# EAGLE design ArduinoNano LearningBot 4-16-18 (EAGLE 8.4.1)
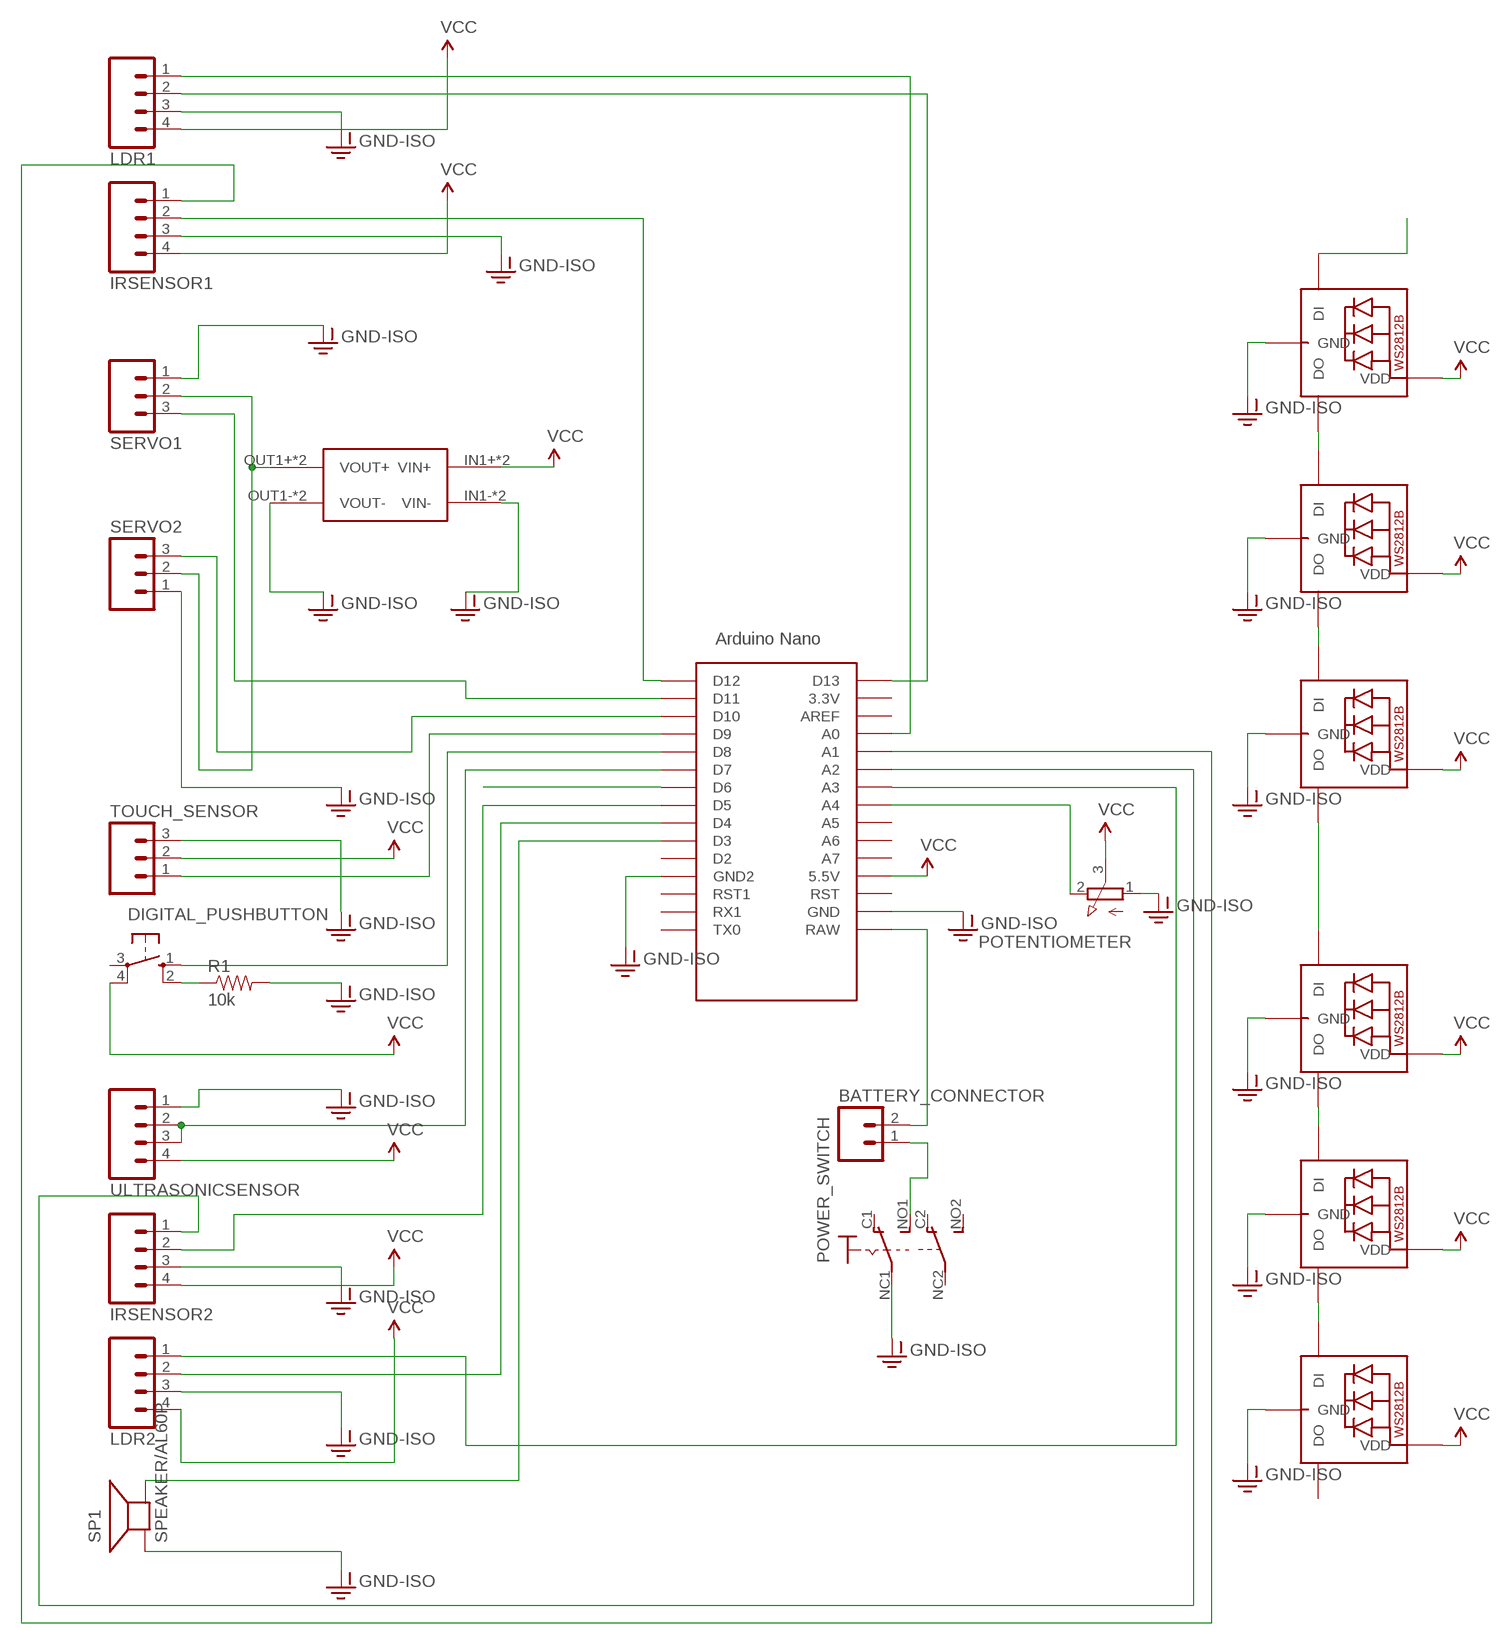
[diagram p0: schematic, sheet 1]

## Parts
BATTERY_CONNECTOR  M02-JST-2-PTH-NO_SILK  [JST-2-PTH-NS]
DIGITAL_PUSHBUTTON  10-XX  [B3F-10XX]
IRSENSOR1  M04LOCK  [1X04_LOCK]
IRSENSOR2  M04LOCK  [1X04_LOCK]
LDR1  M04LOCK  [1X04_LOCK]
LDR2  M04LOCK  [1X04_LOCK]
LED-1  WS2812B5050  [WS2812B]
LED-2  WS2812B5050  [WS2812B]
LED-3  WS2812B5050  [WS2812B]
LED-4  WS2812B5050  [WS2812B]
LED-5  WS2812B5050  [WS2812B]
LED-6  WS2812B5050  [WS2812B]
POTENTIOMETER  3RP/1610N-VERTICAL  [3RP/1610N-VERTICAL]
POWER_SWITCH  SWITCH_320-938  [PS22F03]
R1  10k  RESISTORPTH-1/4W  [AXIAL-0.4]
SERVO1  M03LOCK  [1X03_LOCK]
SERVO2  M03LOCK  [1X03_LOCK]
SP1  SPEAKER/AL60P  [AL60P]
TOUCH_SENSOR  M03LOCK  [1X03_LOCK]
U$1  ARDUINO-CLONE_NANO  [ARDUINO-CLONE_NANO]
U$3  MP1584  [DC-BRICK]
ULTRASONICSENSOR  M04LOCK  [1X04_LOCK]

## Nets
BUTTON: DIGITAL_PUSHBUTTON.1(S) U$1.D8
GND: IRSENSOR1.3 IRSENSOR2.3 LDR1.3 LDR2.3 LED-1.3-GND(GND) LED-2.3-GND(GND) LED-3.3-GND(GND) LED-4.3-GND(GND) LED-5.3-GND(GND) LED-6.3-GND(GND) POTENTIOMETER.1(A) POWER_SWITCH.NC1(1:P) R1.P$2 SERVO1.1 SP1.1(+) TOUCH_SENSOR.3 U$1.GND U$1.GND1(GND2) ULTRASONICSENSOR.1 ; supply symbol labelled GND-ISO
GND-ISO: U$3.IN1-(VIN-) U$3.IN2-(VIN-) U$3.OUT1-(VOUT-) U$3.OUT2-(VOUT-)
IR_SENSOR1_AO: IRSENSOR1.1 U$1.A1
IR_SENSOR1_DO: IRSENSOR1.2 U$1.D12
IR_SENSOR2_AO: IRSENSOR2.1 U$1.A2
IR_SENSOR2_DO: IRSENSOR2.2 U$1.D5
LDR1_AO: LDR1.1 U$1.A0
LDR1_DO: LDR1.2 U$1.D13
LDR2_AO: LDR2.1 U$1.A3
LDR2_DO: LDR2.2 U$1.D4
LED-1: LED-2.4-DIN(DI) U$1.D6
N$1: LED-1.4-DIN(DI) LED-3.2-DOUT(DO)
N$2: LED-4.2-DOUT(DO) LED-5.4-DIN(DI)
N$3: DIGITAL_PUSHBUTTON.2(S1) R1.P$1
N$4: LED-5.2-DOUT(DO) LED-6.4-DIN(DI)
N$5: LED-2.2-DOUT(DO) LED-3.4-DIN(DI)
N$6: LED-1.2-DOUT(DO) LED-4.4-DIN(DI)
N$9: BATTERY_CONNECTOR.1 POWER_SWITCH.NO1(1:S)
POTPIN: POTENTIOMETER.2(E) U$1.A4
RAWIN: BATTERY_CONNECTOR.2 U$1.RAW
SERVO1_PIN: SERVO1.3 U$1.D11
SERVO2_PIN: SERVO2.3 U$1.D10
SERVOGND: SERVO2.1 ; supply symbol labelled GND-ISO
SERVOVCC: SERVO1.2 SERVO2.2 U$3.OUT1+(VOUT+) U$3.OUT2+(VOUT+)
SPEAKERPIN: SP1.2(-) U$1.D3
TOUCH_SENSOR: TOUCH_SENSOR.1 U$1.D9
ULTRASONICSENSOR_PIN: U$1.D7 ULTRASONICSENSOR.2 ULTRASONICSENSOR.3
VCC: DIGITAL_PUSHBUTTON.4(P1) IRSENSOR1.4 IRSENSOR2.4 LDR1.4 LDR2.4 LED-1.1-VDD(VDD) LED-2.1-VDD(VDD) LED-3.1-VDD(VDD) LED-4.1-VDD(VDD) LED-5.1-VDD(VDD) LED-6.1-VDD(VDD) POTENTIOMETER.3(S) TOUCH_SENSOR.2 U$1.5V(5.5V) U$3.IN1+(VIN+) U$3.IN2+(VIN+) ULTRASONICSENSOR.4
Unconnected: DIGITAL_PUSHBUTTON.3(P) LED-6.2-DOUT(DO) POWER_SWITCH.C1(1:O) POWER_SWITCH.C2(B:O) POWER_SWITCH.NC2(B:P) POWER_SWITCH.NO2(B:S) U$1.3.3V U$1.A5 U$1.A6 U$1.A7 U$1.AREF U$1.D2 U$1.RST U$1.RST1 U$1.RX1 U$1.TX0

## Library data of the parts
BATTERY_CONNECTOR = SparkFun-Connectors:M02: Standard 2-pin 0.1" header. Use with - straight break away headers ( PRT-00116) - right angle break away headers (PRT-00553) - swiss pins (PRT-00743) - machine pins (PRT-00117) - female headers (PRT-00115) Molex polarized connector foot print use with: PRT-08233 with associated crimp pins and housings. 2.54_SCREWTERM for use with PRT-10571. 3.5mm Screw Terminal footprints for PRT-08084 5mm Screw Terminal footprints for use with PRT-08432
DIGITAL_PUSHBUTTON = switch-omron:10-XX: OMRON SWITCH; MPN: B3F-1000; OC_FARNELL: 176432; OC_NEWARK: 36M3542
IRSENSOR1 IRSENSOR2 LDR1 LDR2 ULTRASONICSENSOR = SparkFun-Connectors:M04: Header 4 Standard 4-pin 0.1" header. Use with straight break away headers (SKU : PRT-00116), right angle break away headers (PRT-00553), swiss pins (PRT-00743), machine pins (PRT-00117), and female headers (PRT-00115). Molex polarized connector foot print use with SKU : PRT-08231 with associated crimp pins and housings. 1MM SMD Version SKU: PRT-10208; PROD_ID: CONN-09696
LED-1-LED-6 = adafruit:WS2812B
POTENTIOMETER = pot:3RP/1610N-VERTICAL: 16mm Potentiometer one level Source: http://www.alphapotentiometers.net/html/16mm_pot_2.html
POWER_SWITCH = ArduinoNano LearningBot 3-15-18:SWITCH_320-938: TOGGLE SWITCH distributor RS Components
R1 = SparkFun-Passives:RESISTOR: Resistor Basic schematic elements and footprints for 0603, 1206, and PTH resistors.
SERVO1 SERVO2 TOUCH_SENSOR = SparkFun-Connectors:M03: Header 3 Standard 3-pin 0.1" header. Use with straight break away headers (SKU : PRT-00116), right angle break away headers (PRT-00553), swiss pins (PRT-00743), machine pins (PRT-00117), and female headers (PRT-00115). Molex polarized connector foot print use with SKU : PRT-08232 with associated crimp pins and housings.
SP1 = adafruit:SPEAKER: SPEAKER Source: Buerklin Added PS12 (for part # PS1240 piezo) http://www.ladyada.net/library/pcb/eaglelibrary.html
U$1 = ArduinoNano LearningBot 3-15-18:ARDUINO-CLONE_NANO: Arduino Nano
U$3 = MP1584-dc-brick:MP1584: MP1584-dc-brick-pcb Step down Input: 4.5V - 28V Ouput 0.8V - 25V max. 3A Cheap on ebay

## Board
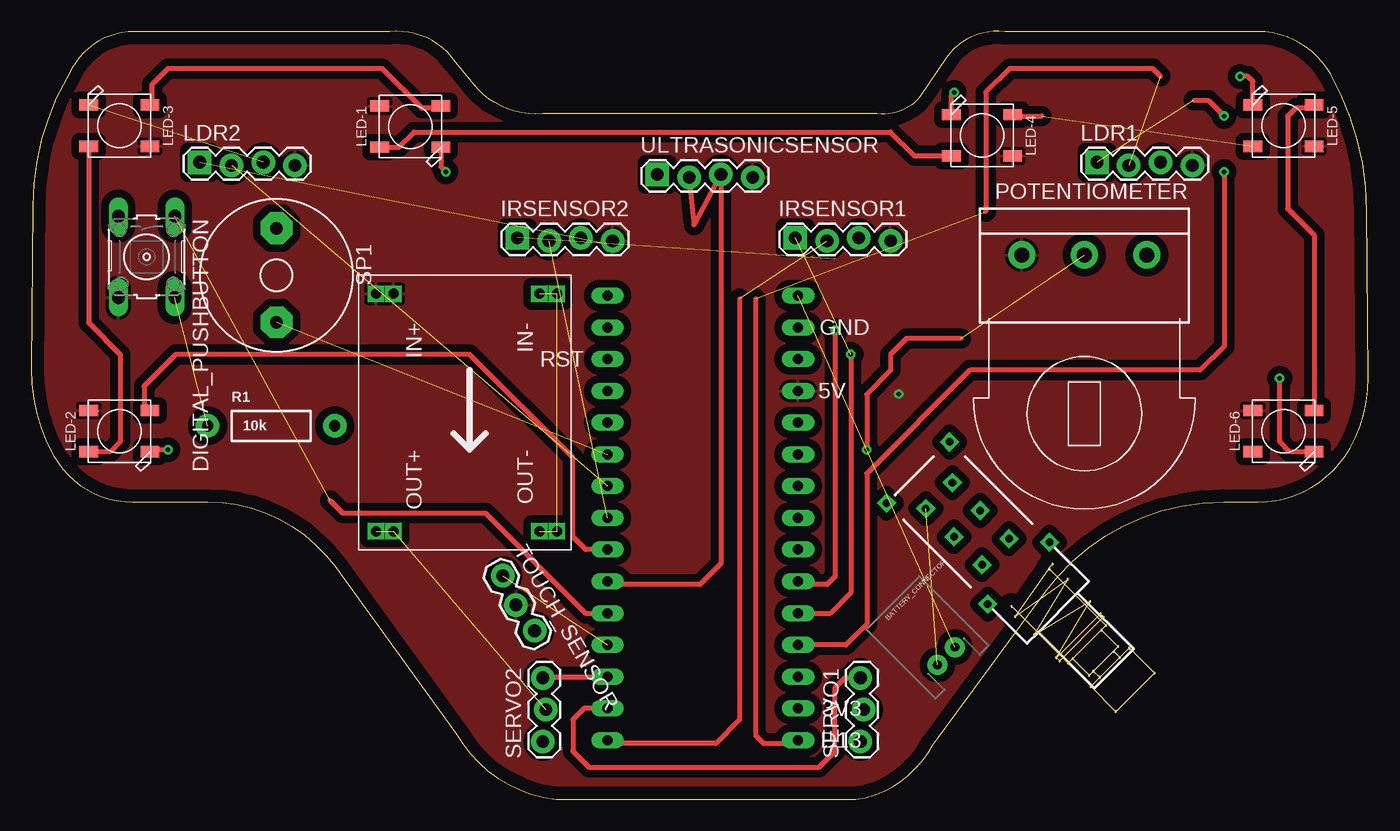
[diagram p1: board, top side]
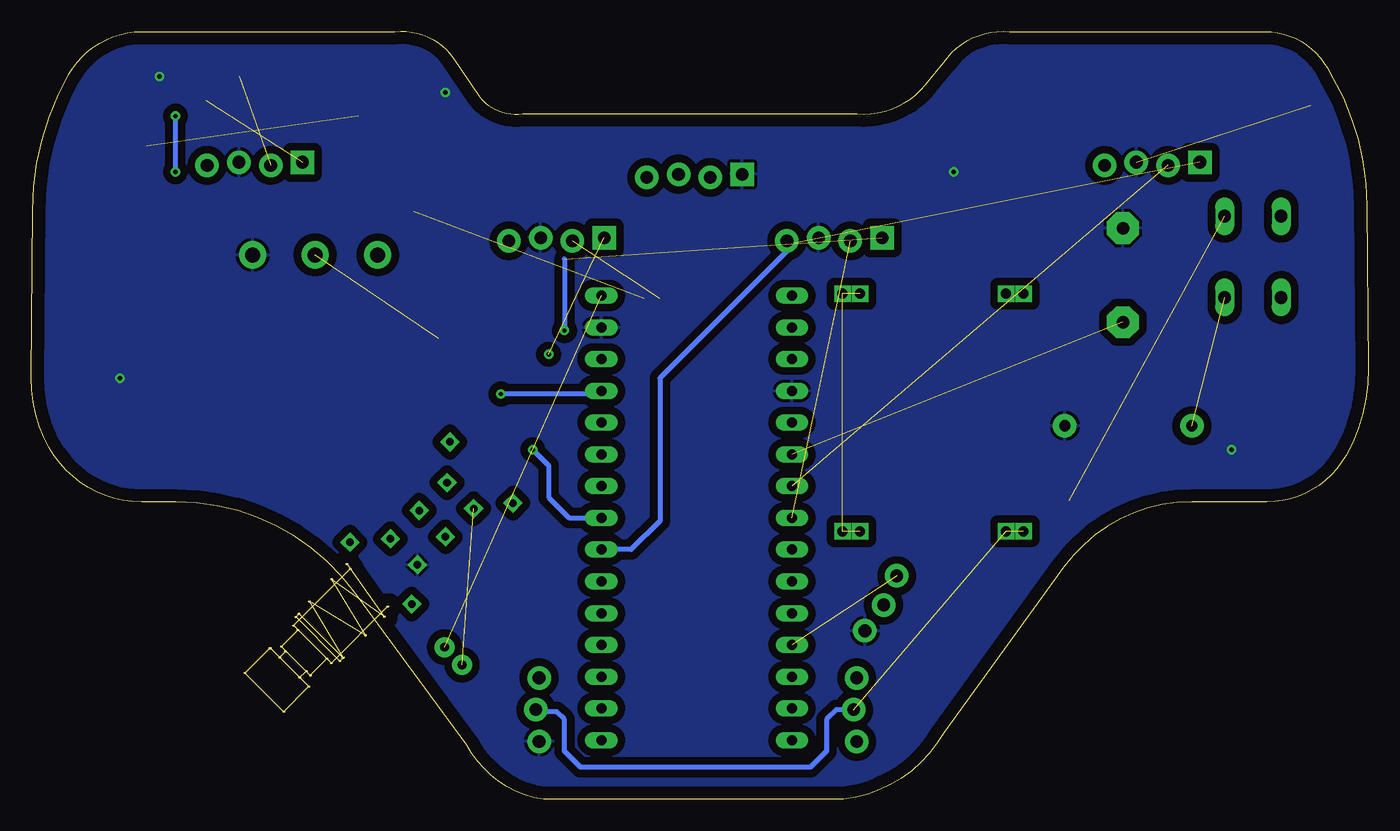
[diagram p2: board, bottom side, seen from below]

Size 106.91 x 61.44 mm. Coordinates in mm from the lower left corner, seen from the top.
Outline: 72.09,4.39 81.05,16.57 arc-54 95.34,23.8 98.07,23.8 arc61 105.45,28.11 arc30 106.91,33.74 106.8,47.14 arc29 103.91,58.01 arc61 98.07,61.42 77.83,61.42 arc61 73.16,59.32 71.05,56.22 arc-61 67.63,54.86 40.88,54.86 arc-61 35.06,57.62 33.94,58.97 arc61 28.67,61.42 8.24,61.42 arc61 3.28,58.52 2.82,57.7 arc29 0.1,47.49 0,34.46 arc30 1.8,27.48 arc61 8.11,23.8 14.1,23.8 arc-54 24.32,18.6 33.94,5.35 arc54 41.96,0 65.93,0 arc54 72.09,4.39
Copper layers (1*16): Top 0.035mm / dielectric 1.5mm / Bottom 0.035mm
Design rules "default": minimum track width 6mil, minimum drill 0.35mm, track to track 6mil, track to pad 6mil, pad to pad 6mil, via to via 6mil, smd to smd 6mil, copper to edge 40mil, drill to drill 6mil, minimum pad ring 10mil, minimum via ring 8mil, stop-mask expansion 4mil, vias tented up to drill 0mil, thermal gap 10mil

### Footprints (pad centres in the part's own frame; a part is rotated, then mirrored left to right if it is on the bottom)
JST-2-PTH-NS = drill 0.7 pad 1.6: 1 -1,0; 2 1,0
B3F-10XX = drill 1.016 long: 1 -3.251,2.261; 2 3.251,2.261; 3 -3.251,-2.261; 4 3.251,-2.261
1X04_LOCK = drill 1.016 pad 1.88 square: 1 0,0.127 | drill 1.016 pad 1.88: 2 2.54,-0.127; 3 5.08,0.127; 4 7.62,-0.127
WS2812B = smd 1.5 x 0.9: 1-VDD 2.45,-1.65; 2-DOUT 2.45,1.65; 3-GND -2.45,1.65; 4-DIN -2.45,-1.65
3RP/1610N-VERTICAL = drill 1.2 pad 2.184: 1 -5,0; 2 0,0; 3 5,0
PS22F03 = drill 0.6 square: 0 -3.175,5.715; 1 3.835,5.613; 2 3.81,-5.715; 3 -3.175,-5.715; C1 -1.27,0; C2 1.702,0; NC1 -1.27,-3.175; NC2 1.727,-3.226; NO1 -1.27,3.175; NO2 1.702,3.15
AXIAL-0.4 = drill 0.9 pad 1.88: P$1 -5.08,0; P$2 5.08,0
1X03_LOCK = drill 1.016 pad 1.88: 1 0,0.127; 2 2.54,-0.127; 3 5.08,0.127
AL60P = drill 1.016 pad 2.54 octagon: 1 -3.759,0; 2 3.759,0
ARDUINO-CLONE_NANO = drill 0.8 long: 3.3V -10.16,24.13; 5V -10.16,-1.27; A0 -10.16,19.05; A1 -10.16,16.51; A2 -10.16,13.97; A3 -10.16,11.43; A4 -10.16,8.89; A5 -10.16,6.35; A6 -10.16,3.81; A7 -10.16,1.27; AREF -10.16,21.59; D2 5.08,1.27; D3 5.08,3.81; D4 5.08,6.35; D5 5.08,8.89; D6 5.08,11.43; D7 5.08,13.97; D8 5.08,16.51; D9 5.08,19.05; D10 5.08,21.59; D11 5.08,24.13; D12 5.08,26.67; D13 -10.16,26.67; GND -10.16,-6.35; GND1 5.08,-1.27; RAW -10.16,-8.89; RST -10.16,-3.81; RST1 5.08,-3.81; RX1 5.08,-6.35; TX0 5.08,-8.89
DC-BRICK = drill 0.8 square: IN1+ 1.5,1.4; IN1- 1.5,14.47; IN2+ 1.5,2.8; IN2- 1.5,15.87; OUT1+ 20.5,1.4; OUT1- 20.5,14.47; OUT2+ 20.5,2.8; OUT2- 20.5,15.87

### Placement (x,y rotation side)
BATTERY_CONNECTOR  73.16,11.48 45 top
DIGITAL_PUSHBUTTON  9.22,43.4 270 top
IRSENSOR1  61.09,44.8 0 top
IRSENSOR2  38.87,44.8 0 top
LDR1  85.22,50.85 0 top
LDR2  13.47,50.85 0 top
LED-1  30.31,53.82 180 top
LED-2  7.04,29.46 180 top
LED-3  7.04,53.89 0 top
LED-4  76.03,53.12 0 top
LED-5  100.13,53.89 0 top
LED-6  100.13,29.46 180 top
POTENTIOMETER  84.2,43.56 180 top
POWER_SWITCH  74.68,21.91 45 top
R1  19.18,29.89 0 top
SERVO1  66.42,4.64 90 top
SERVO2  41.02,4.64 90 top
SP1  19.61,41.93 270 top
TOUCH_SENSOR  37.6,17.83 300 top
U$1  51.16,31.41 180 top
U$3  26.17,41.96 270 top
ULTRASONICSENSOR  50.07,49.88 0 top

### Tracks (layer width: path | path; a pad name or v marks a point on that pad's centre or on a via)
BUTTON  (1 unrouted)
  Top 0.406: U$1.D8 44.33,14.9 36.33,22.91 24.9,22.91 23.88,23.92
GND  (via drill 0.35)  (1 unrouted)
  Top 0.406: LED-5.3-GND 97.68,57.44 97.29,57.83 v96.65,57.83 | LED-2.3-GND 9.67,27.99 v10.93,27.99 | LED-6.3-GND 100.64,27.81 99.83,28.62 v99.83,33.7 | LED-1.3-GND 32.76,50.61 v33.15,50.21 | LED-4.3-GND 73.58,56.35 v73.79,56.56
  pour Bottom (isolate 0.61): -1.77,69.26 115.07,69.26 115.07,-0.59 -1.77,-0.59
GND-ISO  (3 unrouted)
IR_SENSOR1_AO  (via drill 0.35)  (1 unrouted)
  Top 0.406: U$1.A1 63.88,14.9 65.54,16.56 v65.54,35.61
IR_SENSOR1_DO  (1 unrouted)
  Top 0.406: 56.65,40.05 56.65,6.4 54.74,4.49 46.33,4.49 U$1.D12
IR_SENSOR2_AO  (via drill 0.35)  (1 unrouted)
  Top 0.406: U$1.A2 61.57,17.19 63.63,17.19 64.27,17.83 v64.27,37.51
  Bottom 0.406: 64.27,43.23 v64.27,37.51
IR_SENSOR2_DO  (1 unrouted)
LDR1_AO  (via drill 0.35)  (1 unrouted)
  Top 0.406: 92.97,55.93 94.11,55.93 v95.38,54.66 | U$1.A0 65.15,12.36 66.81,14.02 66.81,26.08 75.06,34.34 93.48,34.34 95.38,36.24 v95.38,50.21
  Bottom 0.406: v95.38,54.66 v95.38,50.21
LDR1_DO  (2 unrouted)
  Top 0.406: 90.3,57.83 89.67,58.47 78.24,58.47 76.33,56.56 76.33,47.04 | 57.92,40.05 57.92,5.13 58.55,4.49 61.07,4.49 U$1.D13
LDR2_AO  (1 unrouted)
  Bottom 0.406: 45.85,44.5 56.65,33.7 56.65,22.27 58.93,19.98 U$1.A3
LDR2_DO  (1 unrouted)
LED-1
  Top 0.406: U$1.D6 44.33,19.98 43.31,21 43.31,27.35 35.06,35.61 11.56,35.61 9.02,33.07 9.02,31.58 LED-2.4-DIN
N$1
  Top 0.406: LED-3.2-DOUT 9.66,55.71 9.66,57.2 10.93,58.47 28.07,58.47 31.25,55.29 32.58,55.29 LED-1.4-DIN
N$2  (1 unrouted)
  Top 0.406: LED-4.2-DOUT 78.59,54.66 80.78,54.66
N$3  (1 unrouted)
N$4
  Top 0.406: LED-6.4-DIN 102.58,45.13 100.46,47.25 100.46,54.66 101.1,55.29 102.33,55.29 LED-5.2-DOUT
N$5
  Top 0.406: LED-3.4-DIN 4.59,38.13 7.12,35.61 7.12,28.62 6.3,27.81 LED-2.2-DOUT
N$6
  Top 0.406: LED-1.2-DOUT 29.39,52.17 30.61,53.39 68.71,53.39 70.62,51.48 73.56,51.48 LED-4.4-DIN
N$9  (1 unrouted)
POTPIN  (via drill 0.35)  (1 unrouted)
  Top 0.406: 74.35,36.88 69.98,36.88 68.71,35.61 68.71,34.34 66.81,32.43 v66.81,27.99
  Bottom 0.406: v66.81,27.99 65.54,26.72 65.54,24.18 63.88,22.52 U$1.A4
RAWIN  (1 unrouted)
SERVO1_PIN
  Top 0.406: U$1.D11 44.2,7.28 43.31,6.4 43.31,3.86 44.58,2.59 63,2.59 64.27,3.86 64.27,8.94 65.05,9.72 SERVO1.3
SERVO2_PIN
  Top 0.406: SERVO2.3 40.36,9.82 U$1.D10
SERVOVCC  (2 unrouted)
  Bottom 0.406: SERVO2.2 42.52,7.18 43.31,6.4 43.31,3.86 44.58,2.59 63,2.59 64.27,3.86 64.27,6.4 64.9,7.03 67.03,7.03 SERVO1.2
SPEAKERPIN  (1 unrouted)
TOUCH_SENSOR  (1 unrouted)
ULTRASONICSENSOR_PIN
  Top 0.406: ULTRASONICSENSOR.2 52.99,45.94 ULTRASONICSENSOR.3 55.15,18.87 53.47,17.19 46.33,17.19 U$1.D7
VCC  (via drill 0.35)
  Bottom 0.406: U$1.5V 61.57,32.43 v69.35,32.43
  pour Top (isolate 0.61): -4.95,67.36 111.89,67.36 111.89,-2.49 -4.95,-2.49